# EAGLE design AutoThresholdPulseSensor (EAGLE 7.3.0)
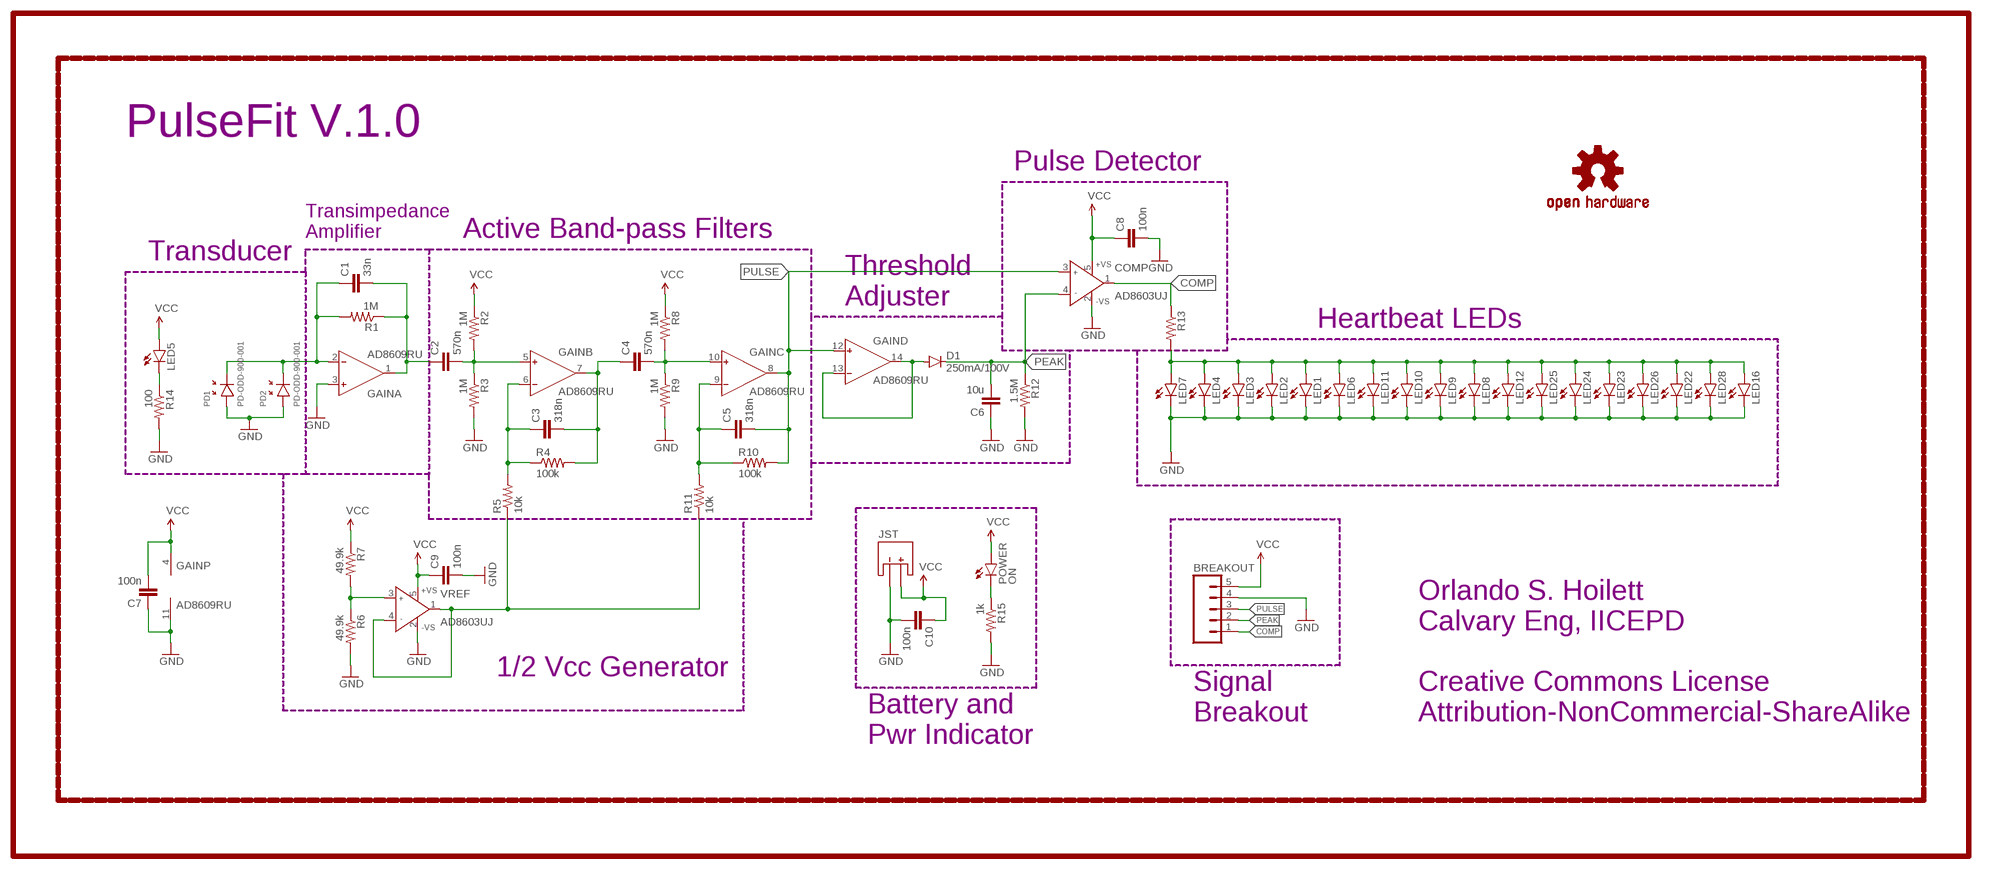
[diagram p0: schematic, sheet 1]

## Parts
BREAKOUT  M05NO_SILK  [1X05_NO_SILK]
C1  33n  C-EUC0402  [C0402]
C2  570n  C-EUC0402  [C0402]
C3  318n  C-EUC0402  [C0402]
C4  570n  C-EUC0402  [C0402]
C5  318n  C-EUC0402  [C0402]
C6  10u  C-EUC0402  [C0402]
C7  100n  C-EUC0402  [C0402]
C8  100n  C-EUC0402  [C0402]
C9  100n  C-EUC0402  [C0402]
C10  100n  C-EUC0402  [C0402]
COMP  AD8603UJ  [SOT23-5]
D1  250mA/100V  DIODEBAS16  [SOD-323]
GAIN  AD8609RU  [TSSOP14]
JST  JST-PTH  [JST-2-PTH-VERT]
LED1  LED5MM  [LED5MM]
LED2  LED5MM  [LED5MM]
LED3  LED5MM  [LED5MM]
LED4  LED5MM  [LED5MM]
LED5  LED0603  [LED-0603]
LED6  LED5MM  [LED5MM]
LED7  LED5MM  [LED5MM]
LED8  LED5MM  [LED5MM]
LED9  LED5MM  [LED5MM]
LED10  LED5MM  [LED5MM]
LED11  LED5MM  [LED5MM]
LED12  LED5MM  [LED5MM]
LED16  LED5MM  [LED5MM]
LED22  LED5MM  [LED5MM]
LED23  LED5MM  [LED5MM]
LED24  LED5MM  [LED5MM]
LED25  LED5MM  [LED5MM]
LED26  LED5MM  [LED5MM]
LED28  LED5MM  [LED5MM]
LOGO1  OSHW-LOGOS  [OSHW-LOGO-S]
PD1  PD-ODD-900-001  [SMD-PD-01]
PD2  PD-ODD-900-001  [SMD-PD-01]
POWER  ON  LED0603  [LED-0603]
R1  1M  R-US_R0402  [R0402]
R2  1M  R-US_R0402  [R0402]
R3  1M  R-US_R0402  [R0402]
R4  100k  R-US_R0402  [R0402]
R5  10k  R-US_R0402  [R0402]
R6  49.9k  R-US_R0402  [R0402]
R7  49.9k  R-US_R0402  [R0402]
R8  1M  R-US_R0402  [R0402]
R9  1M  R-US_R0402  [R0402]
R10  100k  R-US_R0402  [R0402]
R11  10k  R-US_R0402  [R0402]
R12  1.5M  R-US_R0402  [R0402]
R13  R-US_R0402  [R0402]
R14  100  R-US_R0402  [R0402]
R15  1k  R-US_R0402  [R0402]
VREF  AD8603UJ  [SOT23-5]

## Nets
1/2-VDD: R5.1 R11.1 VREF.1(OUT) VREF.4(IN-)
ANODE: LED1.A LED2.A LED3.A LED4.A LED6.A LED7.A LED8.A LED9.A LED10.A LED11.A LED12.A LED16.A LED22.A LED23.A LED24.A LED25.A LED26.A LED28.A R13.2
COMP: BREAKOUT.1 COMP.1(OUT) R13.1
GND: BREAKOUT.4 C6.1 C7.1 C8.2 C9.2 C10.2 COMP.2(-VS) GAIN.3(A:IN+) GAIN.11(P:V-) JST.- LED1.K(C) LED2.K(C) LED3.K(C) LED4.K(C) LED6.K(C) LED7.K(C) LED8.K(C) LED9.K(C) LED10.K(C) LED11.K(C) LED12.K(C) LED16.K(C) LED22.K(C) LED23.K(C) LED24.K(C) LED25.K(C) LED26.K(C) LED28.K(C) PD1.ANODE(+) PD2.ANODE(+) R3.2 R6.2 R9.2 R12.2 R14.2 R15.2 VREF.2(-VS)
N$1: C1.1 GAIN.2(A:IN-) PD1.CATHODE(-) PD2.CATHODE(-) R1.2
N$2: C1.2 C2.1 GAIN.1(A:OUT) R1.1
N$3: C4.2 GAIN.10(C:IN+) R8.2 R9.1
N$4: C2.2 GAIN.5(B:IN+) R2.2 R3.1
N$5: C3.1 GAIN.6(B:IN-) R4.1 R5.2
N$6: C3.2 C4.1 GAIN.7(B:OUT) R4.2
N$7: R6.1 R7.2 VREF.3(IN+)
N$8: C5.1 GAIN.9(C:IN-) R10.1 R11.2
N$9: LED5.C R14.1
N$10: D1.A GAIN.13(D:IN-) GAIN.14(D:OUT)
N$12: POWER.C R15.1
PEAK: BREAKOUT.2 C6.2 COMP.4(IN-) D1.C R12.1
PULSE: BREAKOUT.3 C5.2 COMP.3(IN+) GAIN.8(C:OUT) GAIN.12(D:IN+) R10.2
VCC: BREAKOUT.5 C7.2 C8.1 C9.1 C10.1 COMP.5(+VS) GAIN.4(P:V+) JST.+ LED5.A POWER.A R2.1 R7.1 R8.1 VREF.5(+VS)

## Notes on the sheet
- PulseFit V.1.0
- Pulse Detector
- Transimpedance
  Amplifier
- Active Band-pass Filters
- Transducer
- Threshold
  Adjuster
- Heartbeat LEDs
- 1/2 Vcc Generator
- Signal
  Breakout
- Orlando S. Hoilett
  Calvary Eng, IICEPD
  
  Creative Commons License
  Attribution-NonCommercial-ShareAlike
- Battery and
  Pwr Indicator

## Library data of the parts
BREAKOUT = SparkFun-Connectors:M05: Header 5 Standard 5-pin 0.1" header. Use with straight break away headers (SKU : PRT-00116), right angle break away headers (PRT-00553), swiss pins (PRT-00743), machine pins (PRT-00117), and female headers (PRT-00115). Molex polarized connector foot print use with SKU : PRT-08230 with associated crimp pins and housings.
C1-C10 = resistor:C-EU: CAPACITOR, European symbol
COMP VREF = analog-devices:AD8603: Precision Micropower, Low Noise CMOS, Rail-to-Rail Input/Output Operational Amplifiers Source: http://www.analog.com/static/imported-files/data_sheets/AD8603_8607_8609.pdf; MF: ALTERA CORPORATION; MPN: AD8603AUJZ-REEL7; OC_FARNELL: 1651290; OC_NEWARK: 59K6904
D1 = SparkFun-DiscreteSemi:DIODE: Diode These are standard reverse protection diodes and small signal diodes. SMA package can handle up to about 1A. SOD-323 can handle about 200mA. What the SOD-323 package when ordering, there are some mfgs out there that are 5-pin packages.; PROD_ID: DIO-09646
GAIN = analog-devices:AD8609: Precision Micropower, Low Noise CMOS, Rail-to-Rail Input/Output Operational Amplifiers Source: http://www.analog.com/static/imported-files/data_sheets/AD8603_8607_8609.pdf; MF: ALTERA CORPORATION; MPN: AD8609ARUZ; OC_FARNELL: 1464994; OC_NEWARK: 59K6934
JST = Orlando:JST-PTH
LED1-LED12 LED16 LED22-LED26 LED28 POWER = SparkFun-LED:LED: LEDs Standard schematic elements and footprints for 5mm, 3mm, 1206, and 0603 sized LEDs. 5mm - Spark Fun Electronics SKU : COM-00529 (and others)
LOGO1 = SparkFun-Aesthetics:OSHW-LOGO: Open Source Hardware Logo This logo indicates the piece of hardware it is found on incorporates a OSHW license and/or adheres to the definition of open source hardware found here: http://freedomdefined.org/OSHW
PD1 PD2 = Orlando:PD-ODD-900-001
R1-R15 = resistor:R-US_: RESISTOR, American symbol

## Board
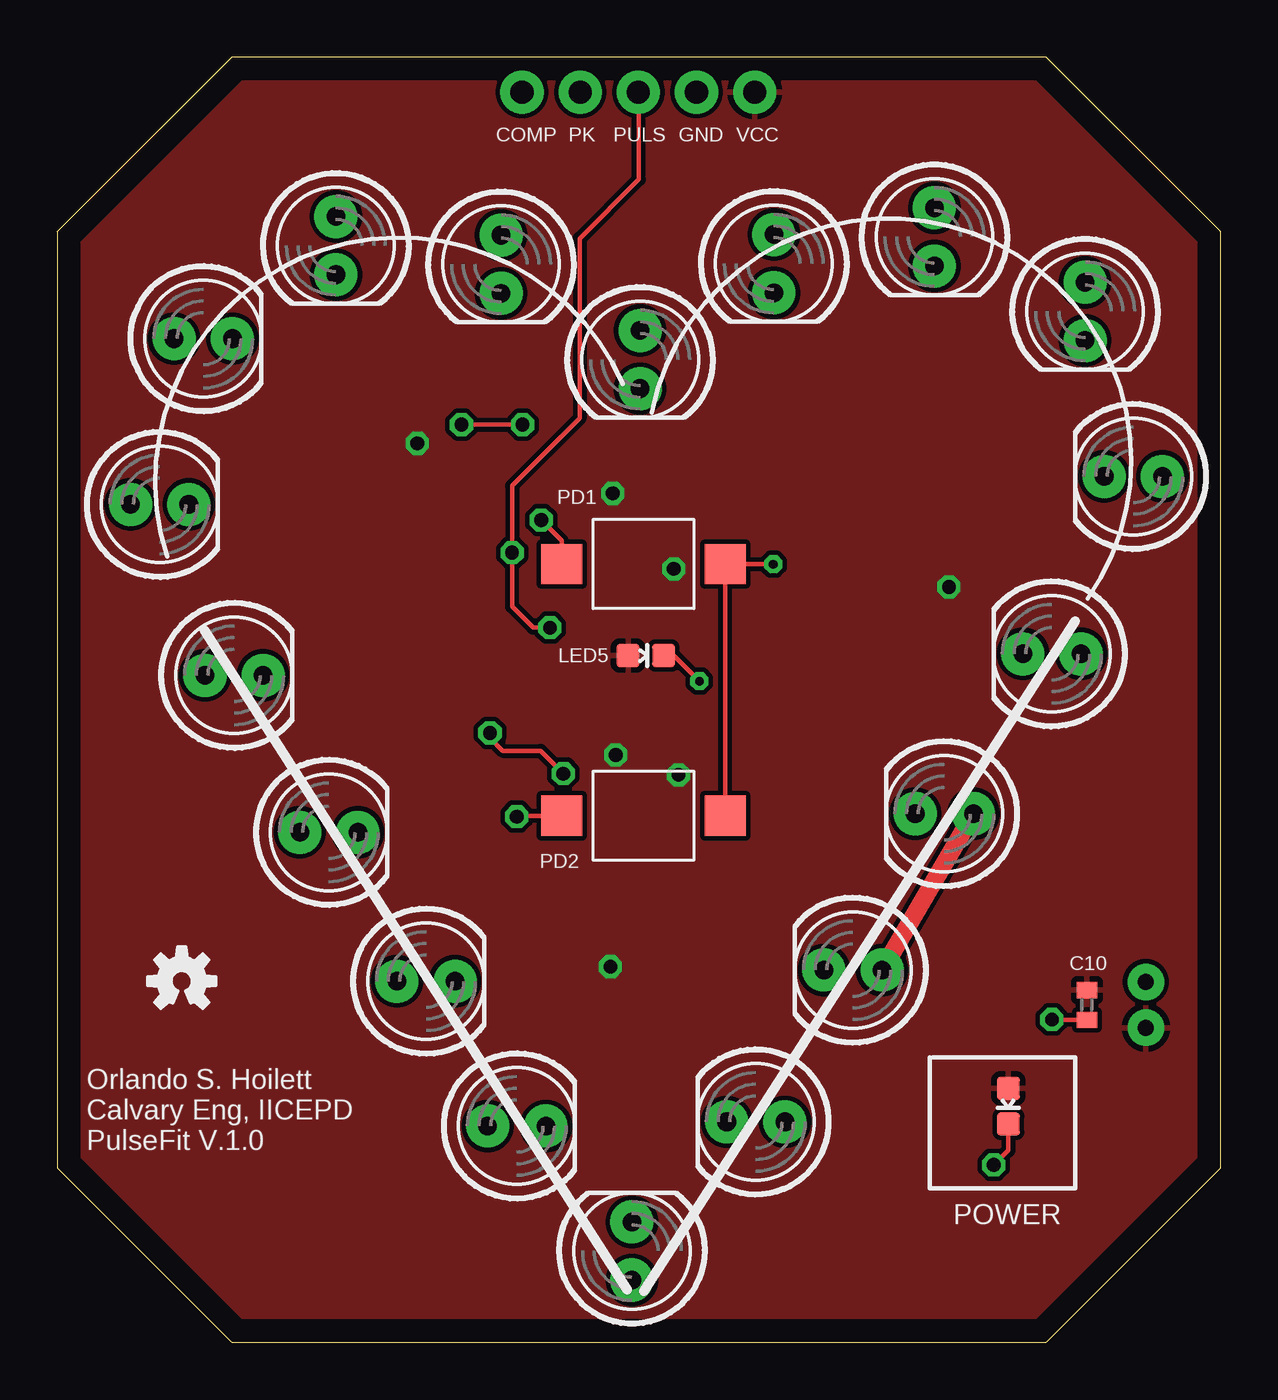
[diagram p1: board, top side]
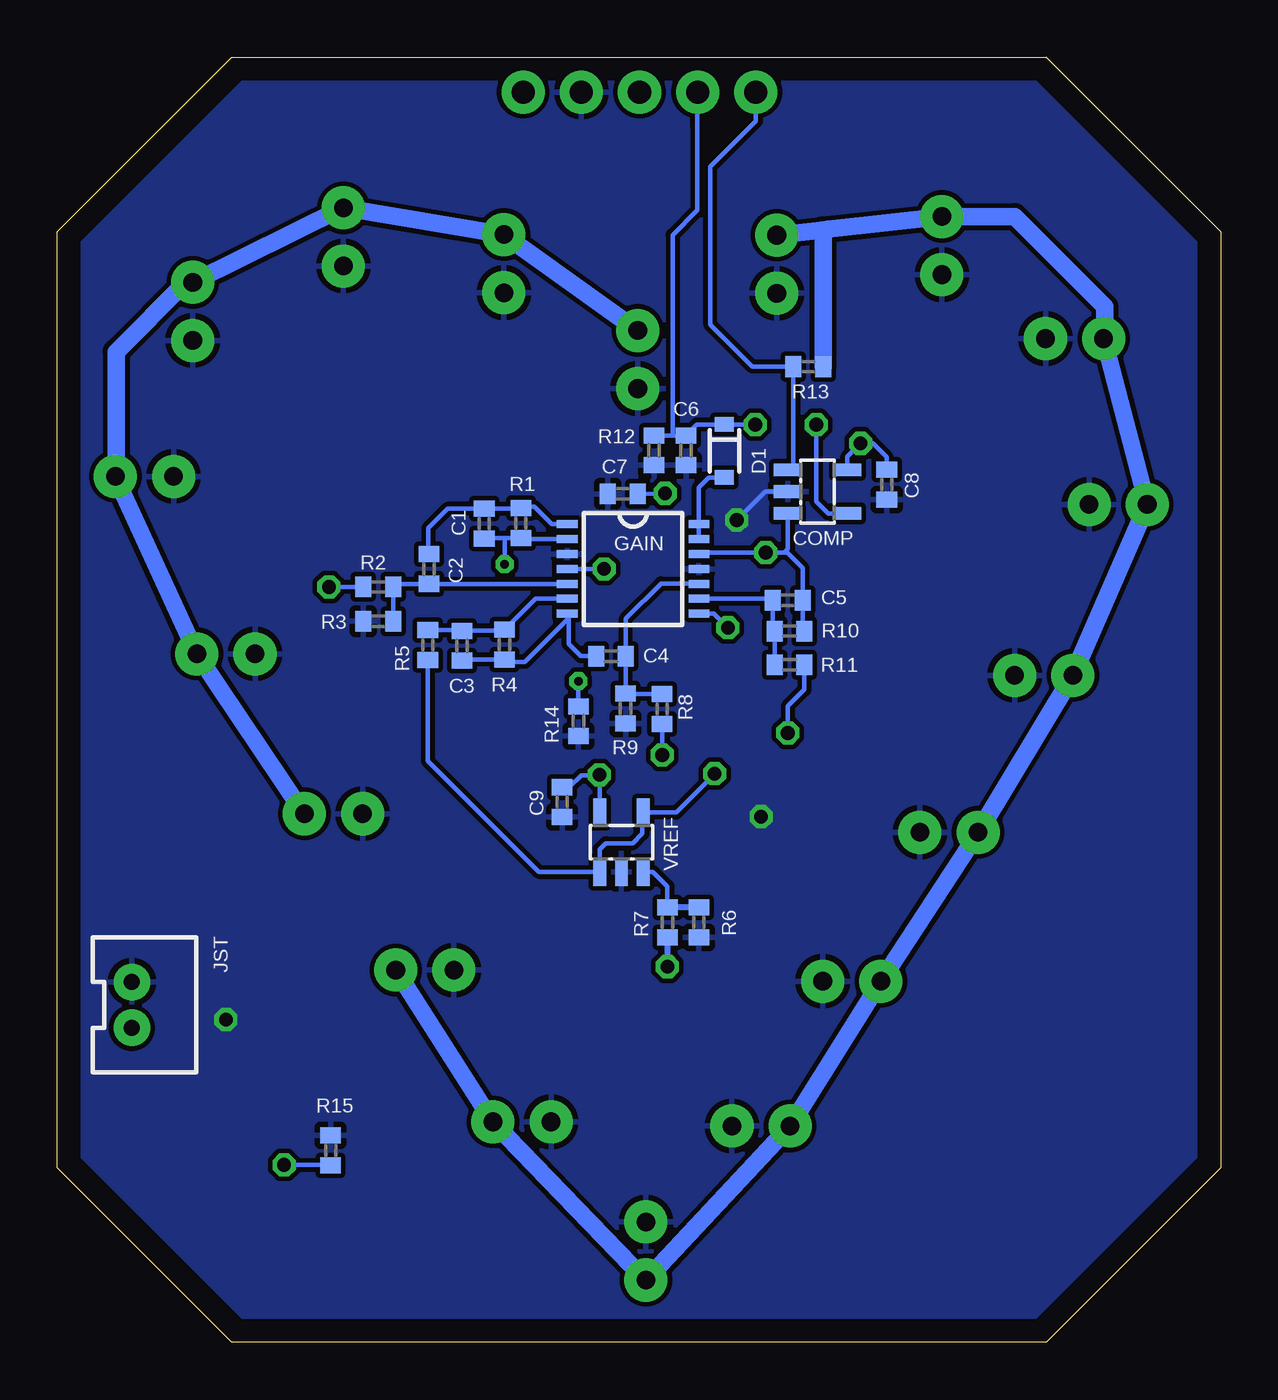
[diagram p2: board, bottom side, seen from below]

Size 50.8 x 56.13 mm. Coordinates in mm from the lower left corner, seen from the top.
Outline: 7.62,0 43.18,0 50.8,7.62 50.8,48.51 43.18,56.13 7.62,56.13 0,48.51 0,7.62 7.62,0
Copper layers (1*16): Top 0.035mm / dielectric 1.5mm / Bottom 0.035mm
Design rules "default": minimum track width 10mil, minimum drill 24mil, track to track 8mil, track to pad 8mil, pad to pad 8mil, via to via 8mil, smd to smd 8mil, copper to edge 40mil, drill to drill 8mil, minimum pad ring 10mil, minimum via ring 8mil, stop-mask expansion 4mil, vias tented up to drill 0mil, thermal gap 10mil

### Footprints (pad centres in the part's own frame; a part is rotated, then mirrored left to right if it is on the bottom)
1X05_NO_SILK = drill 1.016 pad 1.88: 1 0,0; 2 2.54,0; 3 5.08,0; 4 7.62,0; 5 10.16,0
C0402 = smd 0.7 x 0.9: 1 -0.65,0; 2 0.65,0
SOT23-5 = smd 0.55 x 1.2: 1 -0.95,-1.3; 2 0,-1.3; 3 0.95,-1.3; 4 0.95,1.3; 5 -0.95,1.3
SOD-323 = smd 0.63 x 0.83: A 1.15,0; C -1.15,0
TSSOP14 = smd 0.9 x 0.35: 1 -2.875,1.95; 2 -2.875,1.3; 3 -2.875,0.65; 4 -2.875,0; 5 -2.875,-0.65; 6 -2.875,-1.3; 7 -2.875,-1.95; 8 2.875,-1.95; 9 2.875,-1.3; 10 2.875,-0.65; 11 2.875,0; 12 2.875,0.65; 13 2.875,1.3; 14 2.875,1.95
JST-2-PTH-VERT = drill 0.7 pad 1.6: + 1,-0.55; - -1,-0.55
LED5MM = drill 0.813 pad 1.88: A -1.27,0; K 1.27,0
LED-0603 = smd 1 x 1: A 0,-0.677; C 0,0.877
SMD-PD-01 = smd 1.8 x 1.75: ANODE -3.575,0; CATHODE 3.575,0
R0402 = smd 0.7 x 0.9: 1 -0.65,0; 2 0.65,0

### Placement (x,y rotation side)
BREAKOUT  20.29,54.61 0 top
C1  32.16,35.76 90 bottom
C2  34.57,33.78 270 bottom
C3  33.12,30.43 270 bottom
C4  26.62,29.97 0 bottom
C5  18.9,32.41 0 bottom
C6  23.34,38.96 90 bottom
C7  26.11,37.06 0 bottom
C8  14.58,37.47 270 bottom
C9  28.75,23.6 270 bottom
C10  44.96,14.73 270 top
COMP  17.6,37.16 270 bottom
D1  21.67,38.94 270 bottom
GAIN  25.65,33.78 0 bottom
JST  46.99,14.74 270 bottom
LED1  4.47,36.6 0 top
LED2  25.45,42.93 270 top
LED3  31.29,47.12 270 top
LED4  38.3,48.29 270 top
LED5  25.6,30 270 top
LED6  44.88,45.03 270 top
LED7  46.99,37.82 180 top
LED8  30.51,9.63 180 top
LED9  25.1,3.99 90 top
LED10  43.43,30.07 180 top
LED11  34.75,16.26 180 top
LED12  38.74,23.09 180 top
LED16  19.38,47.09 270 top
LED22  20.07,9.45 0 top
LED23  11.86,22.28 0 top
LED24  16.1,15.77 0 top
LED25  7.72,29.13 0 top
LED26  6.38,43.84 0 top
LED28  12.17,47.9 270 top
LOGO1  5.44,15.77 0 top
PD1  25.6,34 0 top
PD2  25.6,23 0 top
POWER  41.53,10.41 180 top
R1  30.56,35.79 270 bottom
R2  36.78,32.99 0 bottom
R3  36.78,31.5 180 bottom
R4  31.27,30.48 270 bottom
R5  34.62,30.45 90 bottom
R6  22.78,18.34 270 bottom
R7  24.16,18.34 90 bottom
R8  24.38,27.66 90 bottom
R9  25.98,27.69 270 bottom
R10  18.82,31.06 0 bottom
R11  18.82,29.59 180 bottom
R12  24.74,38.96 270 bottom
R13  18.01,42.62 0 bottom
R14  28.04,27.13 270 bottom
R15  38.86,8.38 90 bottom
VREF  26.16,21.84 0 bottom

### Tracks (layer width: path | path; a pad name or v marks a point on that pad's centre or on a via)
1/2-VDD  (via drill 0.6)
  Top 0.203: v18.9,26.62 18.9,26.39 19.46,25.83 21.11,25.83 v22.1,24.84
  Bottom 0.203: R11.1 18.17,28.51 18.9,27.79 v18.9,26.62 | R5.1 34.62,25.4 29.77,20.55 VREF.1 27.11,21.53 26.85,21.79 25.68,21.79 25.25,22.23 25.25,23.11 VREF.4 23.77,23.14 22.1,24.82 v22.1,24.84
ANODE
  Top 0.762: LED11.A LED12.A
  Bottom 0.762: LED16.A 17.41,48.58 | 17.41,48.58 17.13,48.62 LED28.A 8.99,49.17 5.05,45.24 5.05,43.89 LED26.A LED1.A LED25.A LED23.A LED24.A LED22.A LED9.A LED8.A LED11.A | LED12.A LED10.A LED7.A 48.24,37.85 48.24,43.26 45.19,46.3 LED6.A LED4.A LED3.A LED2.A | R13.2 17.36,48.53 17.41,48.58
COMP
  Bottom 0.203: COMP.1 18.66,38.35 R13.1 20.45,42.62 22.28,44.45 22.28,51.36 20.3,53.34 BREAKOUT.1
GND  (via drill 0.6)
  Top 0.203: PD2.ANODE 20.1,23 v20.07,22.96 | PD1.ANODE 22.02,35.02 v21.13,35.92 | C10.2 43.45,14.08 v43.43,14.1
  Bottom 0.203: COMP.2 19.89,37.16 v21.13,35.92
  pour Bottom: 50.8,56.13 50.8,0 0,0 0,56.13
N$1  (via drill 0.38)
  Top 0.203: v31.27,33.98 31.25,34 PD1.CATHODE PD2.CATHODE
  Bottom 0.203: GAIN.2 30.5,35.08 R1.2 31.29,35.14 | 31.29,35.14 32.13,35.14 C1.1 | v31.27,33.98 31.27,35.11 31.29,35.14
N$2
  Bottom 0.203: C2.1 34.59,34.46 34.59,35.56 33.74,36.41 C1.2 30.58,36.41 R1.1 30.5,36.5 29.97,36.5 29.21,35.74 GAIN.1
N$3
  Bottom 0.203: GAIN.10 22.79,33.15 24.44,33.15 25.97,31.61 C4.2 25.98,29.96 R9.1 25.96,28.31 R8.2
N$4
  Bottom 0.203: R3.1 R2.2 35.99,33.13 C2.2 GAIN.5
N$5
  Bottom 0.203: GAIN.6 29.91,32.48 R4.1 31.38,31.13 31.42,31.09 C3.1 33.15,31.11 R5.2
N$6
  Bottom 0.203: C3.2 33.07,29.83 R4.2 31.16,29.72 30.38,29.72 28.53,31.57 GAIN.7 28.47,31.78 28.47,30.5 27.94,29.97 C4.1
N$7
  Bottom 0.203: VREF.3 24.79,20.54 24.16,19.91 R7.2
  Bottom 0.254: R6.1 R7.2
N$8
  Bottom 0.203: GAIN.9 19.62,32.48 C5.1 19.55,31.14 R10.1 R11.2
N$9  (via drill 0.38)
  Top 0.203: LED5.C 26.92,30 v28.04,28.88
  Bottom 0.203: v28.04,28.88 R14.1
N$10
  Bottom 0.203: GAIN.13 GAIN.14 22.78,37.34 22.35,37.77 21.69,37.77 D1.A
N$12  (via drill 0.6)
  Top 0.203: POWER.C 41.53,8.38 v40.89,7.75
  Bottom 0.203: v40.89,7.75 38.88,7.75 R15.1
PEAK  (via drill 0.6)
  Top 0.203: v17.65,40.08 v20.32,40.08
  Bottom 0.203: 24.71,39.59 R12.1 23.93,39.61 | BREAKOUT.2 22.84,53.08 22.84,49.45 23.93,48.36 23.93,39.61 | COMP.4 17.13,36.21 17.65,36.73 v17.65,40.08 | 23.93,39.61 C6.2 22.87,40.09 D1.C 21.66,40.08 v20.32,40.08
PULSE  (via drill 0.6)
  Top 0.203: v21.51,31.22 20.78,31.22 19.86,32.13 v19.86,34.49 19.86,37.41 22.81,40.36 22.81,48.21 25.4,50.8 25.4,54.59 BREAKOUT.3
  Bottom 0.203: R10.2 18.25,31.14 C5.2 18.25,33.82 18.92,34.49 19.05,34.49 | 19.05,34.49 v19.86,34.49 22.72,34.49 GAIN.12 | 19.05,34.49 18.9,34.64 COMP.3 19.34,36.21 | GAIN.8 22.13,31.83 v21.51,31.22
VCC  (via drill 0.6)
  Bottom 0.203: R2.1 v38.94,32.99 | GAIN.4 v26.92,33.78 | R8.1 v24.38,25.65 | VREF.5 27.11,24.77 v27.13,24.79 27.15,24.77 27.91,24.77 28.43,24.25 C9.1 | C8.1 14.58,38.66 15.19,39.27 v15.72,39.27 16.3,38.69 COMP.5 | v24.26,37.08 C7.2
  Bottom 0.254: R7.1 v24.16,16.41
  pour Top: 0,56.13 50.8,56.13 50.8,0 0,0

### Text on the board
_tsilk: COMP | PK | PULS | GND | VCC | Orlando S. Hoilett / Calvary Eng, IICEPD / PulseFit V.1.0